# EAGLE design opto1 (EAGLE 5.07)
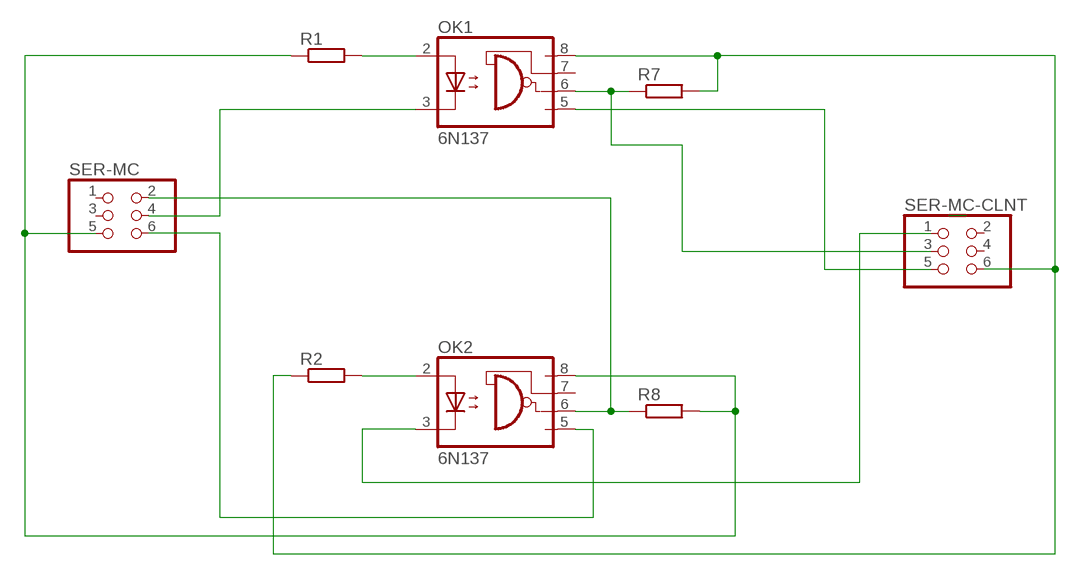
[diagram p0: schematic, sheet 1]

## Parts
OK1  6N137  [DIL08]
OK2  6N137  [DIL08]
R1  R-EU_0207/10  [0207/10]
R2  R-EU_0207/10  [0207/10]
R7  R-EU_0207/10  [0207/10]
R8  R-EU_0207/10  [0207/10]
SER-MC  PINHD-2X3  [2X03]
SER-MC-CLNT  PINHD-2X3  [2X03]

## Nets
N$1: OK1.2(A) R1.2
N$2: OK2.2(A) R2.2
N$4: OK1.3(C) SER-MC.4
N$5: OK2.3(C) SER-MC-CLNT.1
N$6: OK2.8(VCC) R1.1 R8.2 SER-MC.5
N$7: OK1.8(VCC) R2.1 R7.2 SER-MC-CLNT.6
N$8: OK2.5(GND) SER-MC.6
N$9: OK1.5(GND) SER-MC-CLNT.5
N$10: OK2.6(VO) R8.1 SER-MC.2
N$12: OK1.6(VO) R7.1 SER-MC-CLNT.3
Unconnected: OK1.7(VE) OK2.7(VE) SER-MC-CLNT.2 SER-MC-CLNT.4 SER-MC.1 SER-MC.3

## Library data of the parts
OK1 OK2 = optocoupler:6N137: MOTOROLA OPTO COUPLER
R1 R2 R7 R8 = rcl:R-EU_: RESISTOR, European symbol
SER-MC SER-MC-CLNT = pinhead:PINHD-2X3: PIN HEADER

## Board
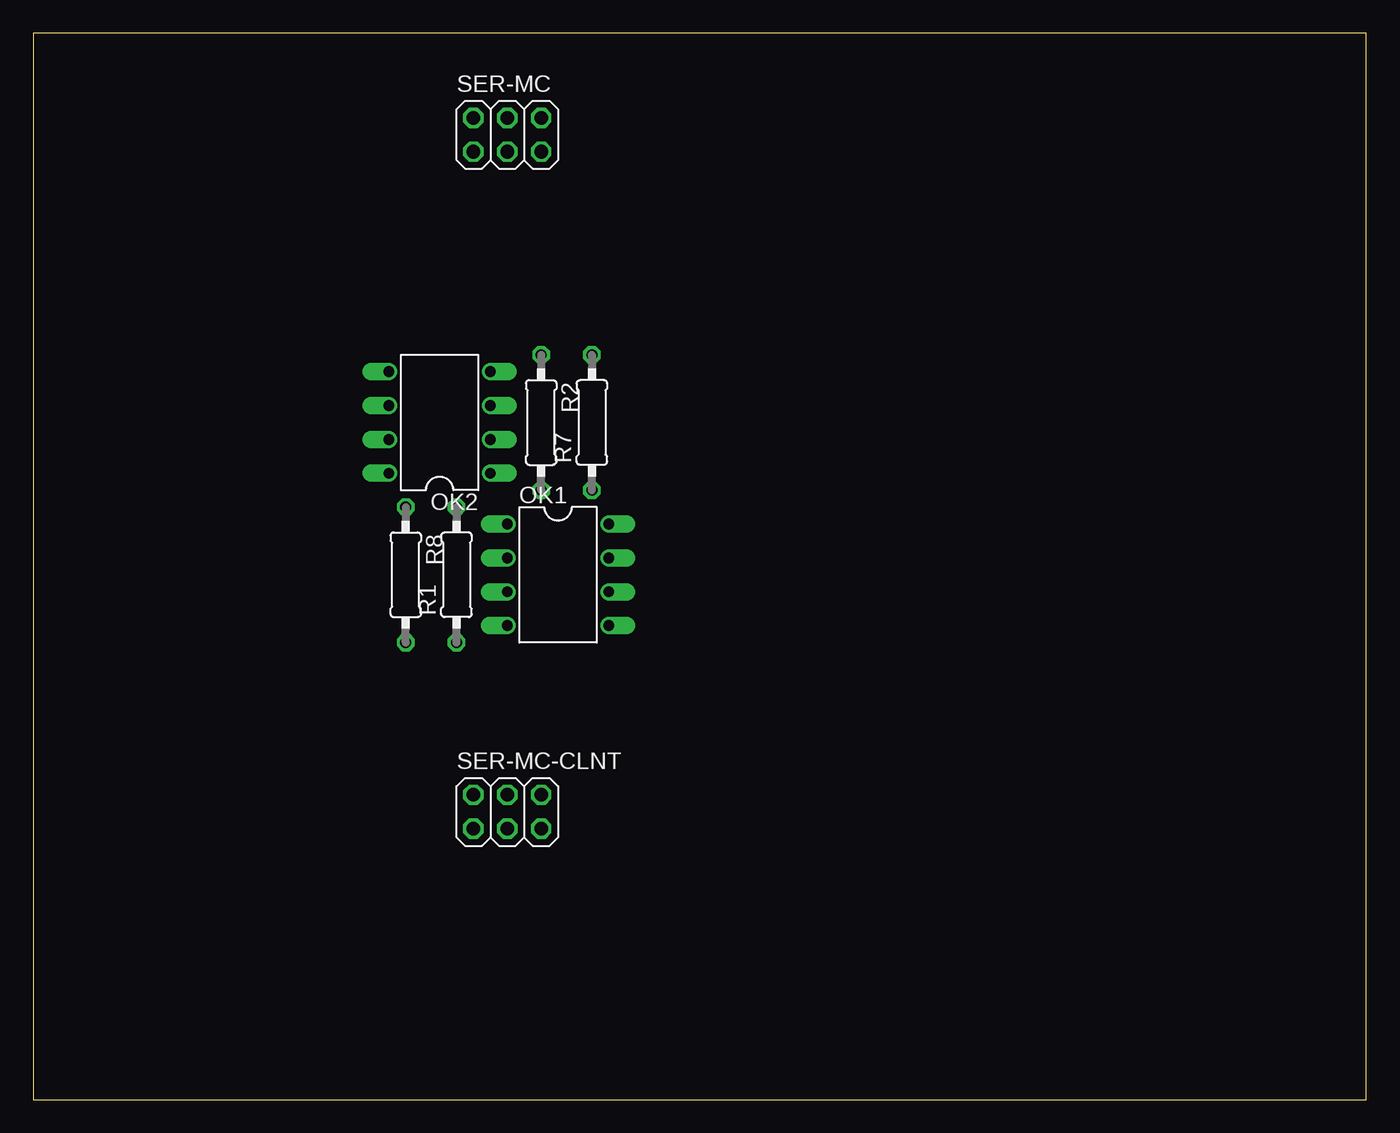
[diagram p1: board, top side]
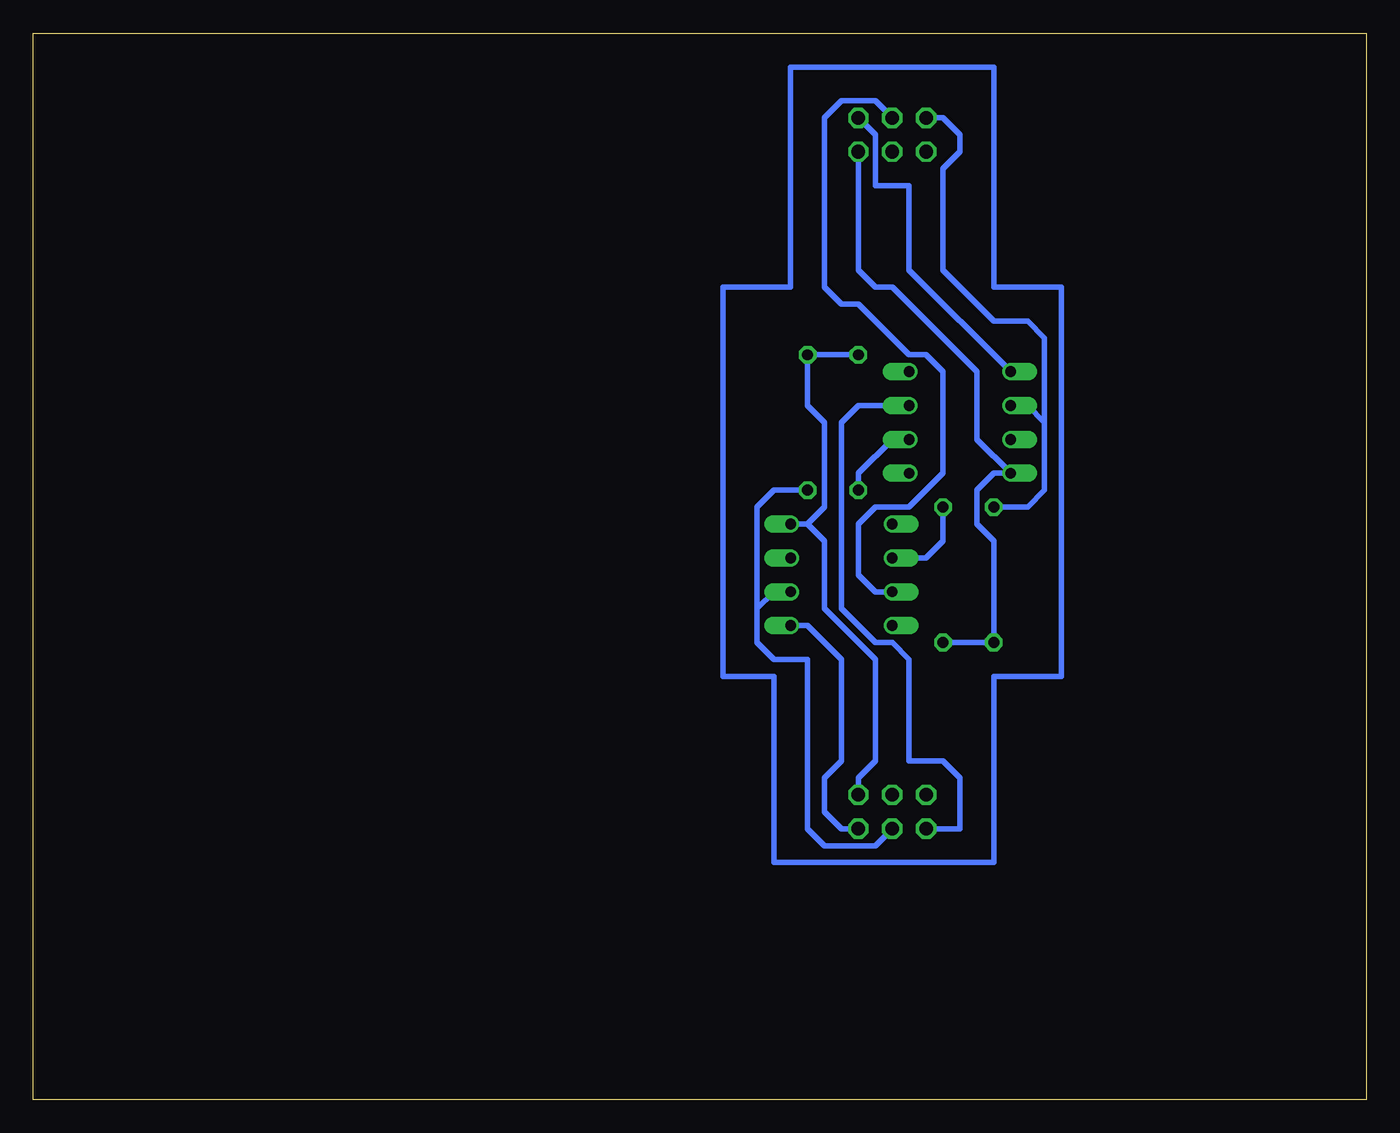
[diagram p2: board, bottom side, seen from below]

Size 100 x 80 mm. Coordinates in mm from the lower left corner, seen from the top.
Outline: 0,0 100,0 100,80 0,80 0,0
Copper layers (1*16): Top 0.0356mm / dielectric 1.5011mm / Bottom 0.0356mm
Design rules "default": minimum track width 7mil, minimum drill 14mil, track to track 7mil, track to pad 7mil, pad to pad 7mil, via to via 7mil, smd to smd 0mil, copper to edge 20mil, drill to drill 8mil, minimum pad ring 10mil, minimum via ring 8mil, stop-mask expansion 4mil, vias tented up to drill 0mil, thermal gap 10mil

### Footprints (pad centres in the part's own frame; a part is rotated, then mirrored left to right if it is on the bottom)
DIL08 = drill 0.813 offset: 1 -3.81,-3.81; 2 -1.27,-3.81; 3 1.27,-3.81; 4 3.81,-3.81; 5 3.81,3.81; 6 1.27,3.81; 7 -1.27,3.81; 8 -3.81,3.81
0207/10 = drill 0.813 octagon: 1 -5.08,0; 2 5.08,0
2X03 = drill 1.016 octagon: 1 -2.54,-1.27; 2 -2.54,1.27; 3 0,-1.27; 4 0,1.27; 5 2.54,-1.27; 6 2.54,1.27

### Placement (x,y rotation side)
OK1  39.37,39.37 270 top
OK2  30.48,50.8 90 top
R1  31.75,39.37 90 top
R2  38.1,50.8 270 top
R7  41.91,50.8 90 top
R8  27.94,39.37 270 top
SER-MC  35.56,72.39 0 top
SER-MC-CLNT  35.56,21.59 0 top

### Tracks (layer width: path | path; a pad name or v marks a point on that pad's centre or on a via)
N$1
  Bottom 0.406: R1.2 31.75,41.91 33.02,40.64 OK1.2
N$2
  Bottom 0.406: OK2.2 35.56,49.53 38.1,46.99 R2.2
N$4
  Bottom 0.406: OK1.3 36.83,38.1 38.1,39.37 38.1,43.18 36.83,44.45 34.29,44.45 31.75,46.99 31.75,54.61 33.02,55.88 34.29,55.88 38.1,59.69 39.37,59.69 40.64,60.96 40.64,73.66 39.37,74.93 36.83,74.93 SER-MC.4
N$5
  Bottom 0.406: SER-MC-CLNT.1 30.48,20.32 30.48,24.13 31.75,25.4 34.29,25.4 34.29,33.02 35.56,34.29 36.83,34.29 39.37,36.83 39.37,50.8 38.1,52.07 OK2.3
N$6
  Bottom 0.406: R1.1 R8.2 27.94,41.91 29.21,43.18 29.21,45.72 27.94,46.99 OK2.8 29.21,49.53 29.21,54.61 35.56,60.96 36.83,60.96 38.1,62.23 SER-MC.5
N$7
  Bottom 0.406: R2.1 R7.2 41.91,52.07 40.64,50.8 40.64,44.45 41.91,43.18 | 41.91,43.18 OK1.8 | 41.91,43.18 40.64,41.91 40.64,36.83 36.83,33.02 36.83,25.4 38.1,24.13 SER-MC-CLNT.6
N$8
  Bottom 0.406: OK2.5 34.29,62.23 34.29,68.58 36.83,68.58 36.83,72.39 SER-MC.6
N$9
  Bottom 0.406: OK1.5 41.91,35.56 39.37,33.02 39.37,25.4 40.64,24.13 40.64,21.59 39.37,20.32 SER-MC-CLNT.5
N$10
  Bottom 0.406: R8.1 25.4,44.45 24.13,45.72 24.13,50.8 | OK2.6 25.4,52.07 24.13,50.8 | 24.13,50.8 24.13,57.15 25.4,58.42 27.94,58.42 31.75,62.23 31.75,69.85 30.48,71.12 30.48,72.39 31.75,73.66 SER-MC.2
N$11
  Bottom 0.406: 43.18,77.47 43.18,60.96 48.26,60.96 48.26,31.75 44.45,31.75 44.45,17.78 27.94,17.78 27.94,31.75 22.86,31.75 22.86,60.96 27.94,60.96 27.94,77.47 43.18,77.47
N$12
  Bottom 0.406: OK1.6 44.45,38.1 45.72,36.83 | SER-MC-CLNT.3 36.83,19.05 40.64,19.05 41.91,20.32 41.91,33.02 44.45,33.02 45.72,34.29 45.72,36.83 | R7.1 44.45,45.72 45.72,44.45 45.72,36.83